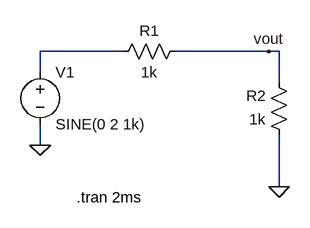
[diagram p0: schematic figure1.asc]
figure1.asc, the LTspice schematic file:
Version 4
SHEET 1 880 680
WIRE 160 80 32 80
WIRE 384 80 240 80
WIRE 400 80 384 80
WIRE 32 112 32 80
WIRE 400 128 400 80
WIRE 32 224 32 192
WIRE 400 288 400 208
FLAG 400 288 0
FLAG 32 224 0
FLAG 384 80 vout
SYMBOL voltage 32 96 R0
WINDOW 123 0 0 Left 0
WINDOW 39 0 0 Left 0
SYMATTR InstName V1
SYMATTR Value SINE(0 2 1k)
SYMBOL res 256 64 R90
WINDOW 0 0 56 VBottom 2
WINDOW 3 32 56 VTop 2
SYMATTR InstName R1
SYMATTR Value 1k
SYMBOL res 416 224 R180
WINDOW 0 36 76 Left 2
WINDOW 3 36 40 Left 2
SYMATTR InstName R2
SYMATTR Value 1k
TEXT 88 304 Left 2 !.tran 2ms

The netlist it stands for:
* figure1.asc
V1 N001 0 SINE(0 2 1k)
R1 vout N001 1k
R2 0 vout 1k
.tran 2ms
.backanno
.end